# Altium project Pinger.PrjPcb
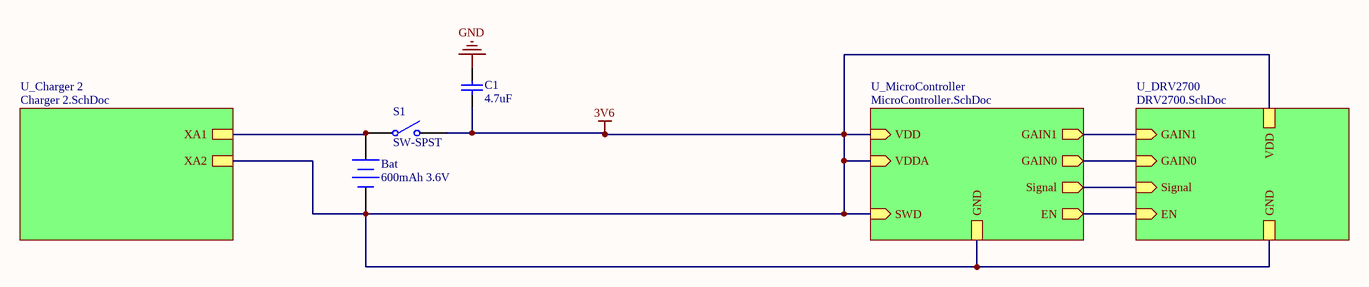
[diagram p0: Master Schematic Sheet.SchDoc]
3 sheets, 33 parts. Net scope: hierarchical (ports join the sheet entries above them; power ports are global).
Board files: Charger V3 PCB.PcbDoc, Pinger Final PCB.PcbDoc
Sheets:
  Master Schematic Sheet.SchDoc
    U_MicroController = MicroController.SchDoc
    U_DRV2700 = DRV2700.SchDoc

## Sheet Master Schematic Sheet.SchDoc
size A4

### Parts
(Parts that share a designator on the sheet are numbered #1, #2 ... from top to bottom, then left to right.)
Bat  600mAh 3.6V  [*FCI_10118193-0001LF_10118193-0001LF(Primary)]
C1#1  value 4.7uF  [CAPC1608N(0603")]  (hidden comment: Cap)
S1  SW-SPST  [SPST-2]

### Sub-sheets
U_Charger 2 = Charger 2.SchDoc (file not in this document): XA1, XA2
U_DRV2700 = DRV2700.SchDoc: EN (in), GAIN0 (in), GAIN1 (in), Signal (in), VDD, GND
U_MicroController = MicroController.SchDoc: GAIN1 (out), GAIN0 (out), Signal (out), EN (out), VDD (in), VDDA (in), GND, SWD (in)

### Nets
3V6: Bat.2(-) C1#1.2 S1.2(NO) ; sheet U_Charger 2/XA2, sheet U_MicroController/VDD, sheet U_MicroController/VDDA, sheet U_MicroController/GND, sheet U_MicroController/SWD, sheet U_DRV2700/VDD, sheet U_DRV2700/GND
GND: C1#1.1
NetBat_1: Bat.1(+) S1.1(COMMON) ; sheet U_Charger 2/XA1
NetDRV_19: sheet U_MicroController/GAIN1, sheet U_DRV2700/GAIN1
NetDRV_20: sheet U_MicroController/EN, sheet U_DRV2700/EN
NetDVR-C3_2: sheet U_MicroController/Signal, sheet U_DRV2700/Signal
NetSTM_12: sheet U_MicroController/GAIN0, sheet U_DRV2700/GAIN0

### Library data of the parts
Bat = Battery: Multicell Battery; Published: 24-Mar-1999; LatestRevisionDate: 17-Jul-2002; LatestRevisionNote: Re-released for DXP Platform.; PackageReference: BAT-2; Publisher: Altium Limited; PackageDescription: Battery; 2 Leads
C1#1 = Cap: Capacitor; Published: 8-Jun-2000; LatestRevisionDate: 17-Jul-2002; LatestRevisionNote: Re-released for DXP Platform.; PackageReference: RAD-0.3; Publisher: Altium Limited; PackageDescription: Radial Cap, Thru-Hole; 2 Leads; 0.3 in Pin Spacing
S1 = SW-SPST: Single-Pole, Single-Throw Switch; Published: 24-Mar-1999; LatestRevisionDate: 17-Jul-2002; LatestRevisionNote: Re-released for DXP Platform.; PackageReference: SPST-2; Publisher: Altium Limited; PackageDescription: Switch; 2 Leads

## Sheet MicroController.SchDoc
size A4; CompanyName: AUVIC; DrawnBy: Aman Nijjar; Organization: AUVIC; DocumentNumber: 2; Revision: 0; SheetNumber: 2; SheetTotal: 3; DocumentName: Pinger; ProjectName: Pinger
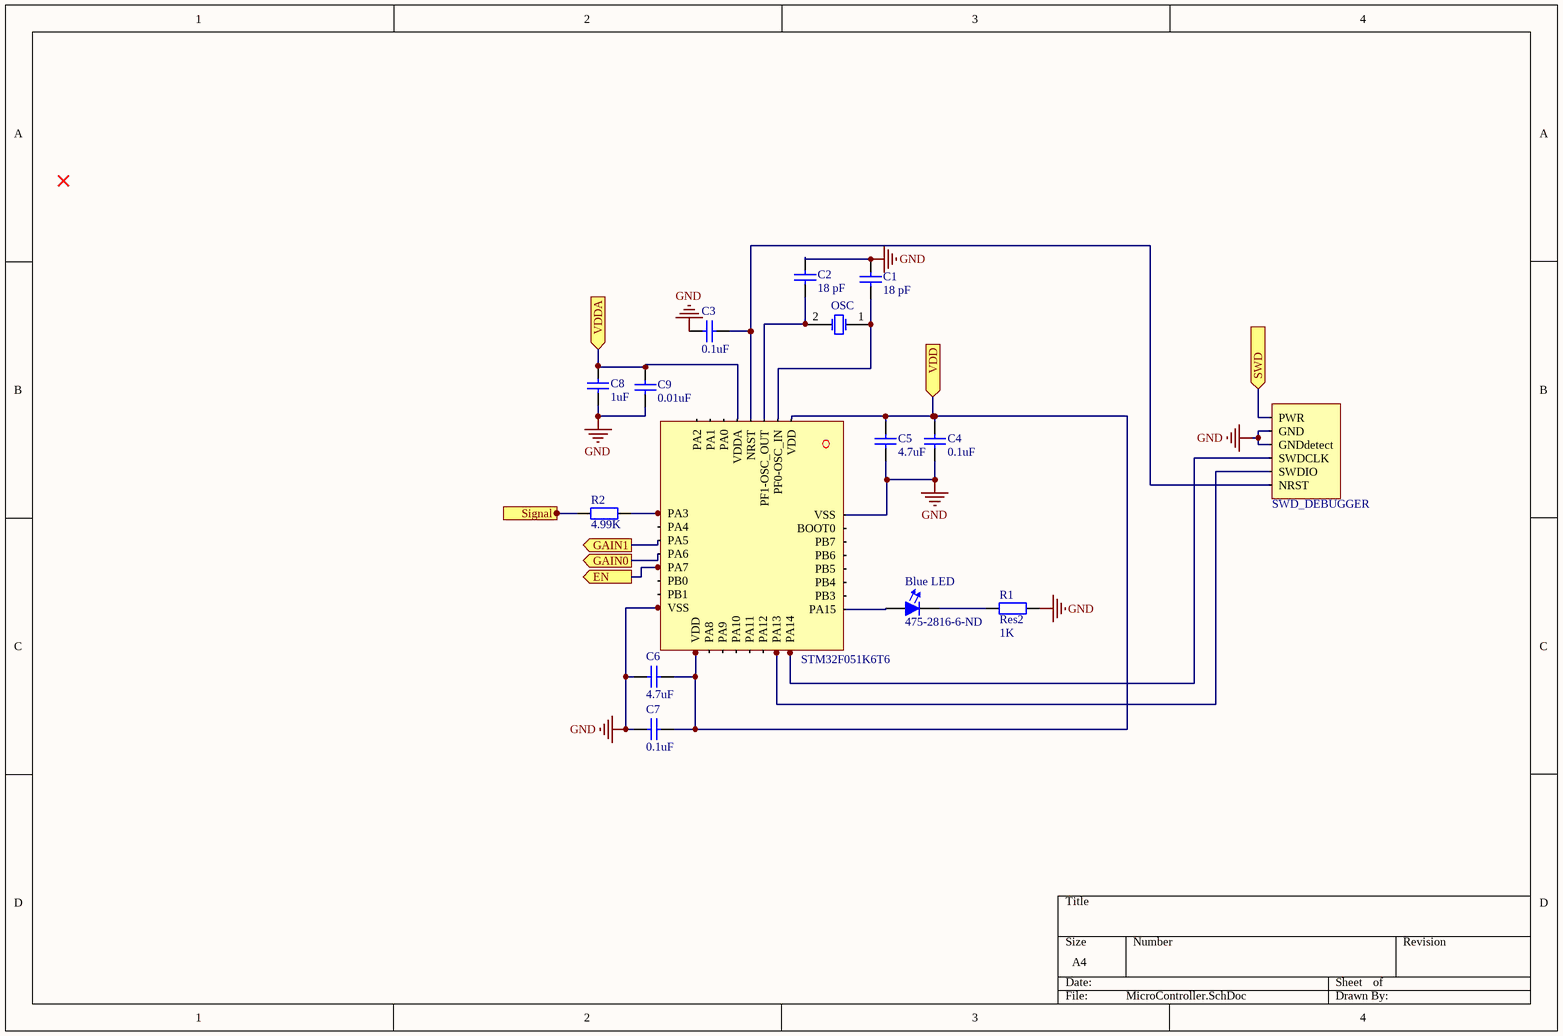
[diagram p1: MicroController.SchDoc]

### Parts
(Parts that share a designator on the sheet are numbered #1, #2 ... from top to bottom, then left to right.)
Blue_LED  Supplier Part Number 1: 475-2816-6-ND  [LED0603]  (hidden comment: Blue)
C1#2  value 18 pF  [CAPC1608N(0603")]  (hidden comment: Cap)
C2  value 18 pF  [CAPC1608N(0603")]  (hidden comment: Cap)
C3  value 0.1uF  [CAPC1608N(0603")]  (hidden comment: Cap)
C4  value 0.1uF  [CAPC1608N(0603")]  (hidden comment: Cap)
C5  value 4.7uF  [CAPC1608N(0603")]  (hidden comment: Cap)
C6  value 4.7uF  [CAPC1608N(0603")]  (hidden comment: Cap)
C7  value 0.1uF  [CAPC1608N(0603")]  (hidden comment: Cap)
C8  value 1uF  [CAPC1608N(0603")]  (hidden comment: Cap)
C9  value 0.01uF  [CAPC1608N(0603")]  (hidden comment: Cap)
DEBUG  SWD_DEBUGGER  [Male_header]
OSC  ABMM2-14.7456MHZ-E2-T  [*OSCSC320X250X100N]  (value not drawn)
R1  Res2  value 1K  [RESC1608N(0603")]
R2  value 4.99K  [RESC1608N(0603")]  (hidden comment: Res2)
STM  STM32F051K6T6  [TQFP68P900X900X160-32N]

### Ports
EN (out), GAIN0 (out), GAIN1 (out), Signal (out), SWD (in), VDD (in), VDDA (in)

### Nets
3V6: C4.1 C5.1 C6.1 C7.1 C8.1 C9.1 DEBUG.1(PWR) STM.17(VDD) ; port VDD, port VDDA, port SWD
GND: C1#2.2 C2.2 C3.1 C4.2 C5.2 C6.2 C7.2 C8.2 C9.2 DEBUG.2(GND) DEBUG.3(GNDdetect) R1.2 STM.16(VSS) STM.32(VSS)
NetBlue_LED_1: Blue_LED.1(Cathode) R1.1
NetBlue_LED_2: Blue_LED.2(Anode) STM.25(PA15)
NetC1#2_1: C1#2.1 OSC.1(OSC1)
NetC2_1: C2.1 OSC.2(OSC2) STM.3(PF1-OSC_OUT)
NetC3_2: C3.2 DEBUG.6(NRST) STM.4(NRST)
NetDEBUG_4: DEBUG.4(SWDCLK) STM.24(PA14)
NetDEBUG_5: DEBUG.5(SWDIO) STM.23(PA13)
NetDRV_19: STM.11(PA5) ; port GAIN1
NetDRV_20: STM.13(PA7) ; port EN
NetDVR-C3_2: R2.1 ; port Signal
NetR2_2: R2.2 STM.9(PA3)
NetSTM_12: STM.12(PA6) ; port GAIN0

Not connected (* = marked no-connect by the designer): STM 1(VDD) 2(PF0-OSC_IN) 5(VDDA) 6(PA0) 7(PA1) 8(PA2) 10(PA4) 14(PB0) 15(PB1) 18(PA8) 19(PA9) 20(PA10) 21(PA11) 22(PA12) 26(PB3) 27(PB4) 28(PB5) 29(PB6) 30(PB7) 31(BOOT0)

### Library data of the parts
Blue_LED = LED, 0603 (1608), Blue, Clear: Colour: Blue; Created By: Lyden Smith; Date Created: 2017-09-19; Supplier 1: Digi-Key
C1#2 C2-C9 = Cap: Capacitor; Published: 8-Jun-2000; LatestRevisionDate: 17-Jul-2002; LatestRevisionNote: Re-released for DXP Platform.; PackageReference: RAD-0.3; Publisher: Altium Limited; PackageDescription: Radial Cap, Thru-Hole; 2 Leads; 0.3 in Pin Spacing
DEBUG = SWD_Header
OSC = XTAL: Crystal Oscillator; Published: 8-Jun-2000; LatestRevisionDate: 17-Jul-2002; LatestRevisionNote: Re-released for DXP Platform.; PackageReference: R38; Publisher: Altium Limited; PackageDescription: Crystal, Thru-Hole; 2 Leads; Body 3.1 x 8.2 mm (Dia.xH)
R1 R2 = Res2: Resistor; Published: 8-Jun-2000; LatestRevisionDate: 17-Jul-2002; LatestRevisionNote: Re-released for DXP Platform.; PackageReference: AXIAL-0.4; Publisher: Altium Limited; PackageDescription: Axial Device, Thru-Hole; 2 Leads; 0.4 in Pin Spacing
STM = STM32F051K6T6: Supplier 1: Mouser; Supplier Part Number 1: 511-STM32F051K6T6

## Sheet DRV2700.SchDoc
size A4
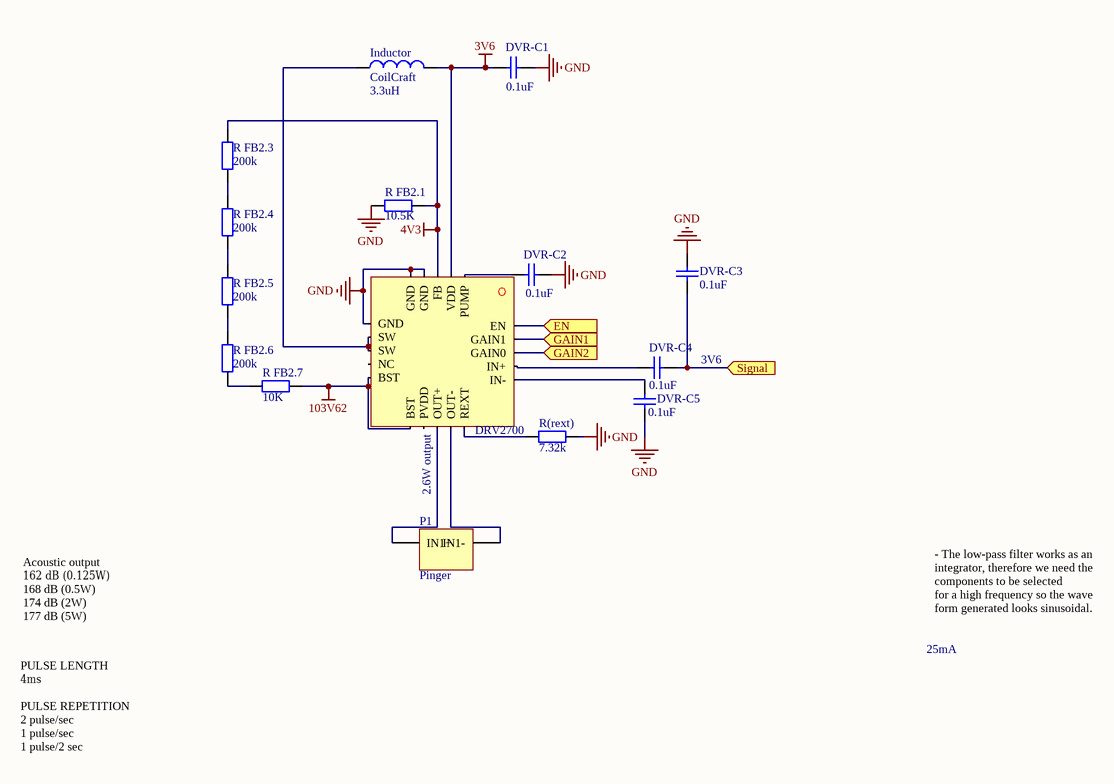
[diagram p2: DRV2700.SchDoc]

### Parts
DRV  DRV2700  [QFN50P400X400X100_HS-21N]
DVR-C1  value 0.1uF  [CAPC1608N(0603")]  (hidden comment: +10V rating and X5R or X7R)
DVR-C2  value 0.1uF  [CAPC1608N(0603")]  (hidden comment: +10V rating and X5R or X7R)
DVR-C3  value 0.1uF  [CAPC1608N(0603")]  (hidden comment: Cap)
DVR-C4  value 0.1uF  [CAPC1608N(0603")]  (hidden comment: Cap)
DVR-C5  value 0.1uF  [CAPC1608N(0603")]  (hidden comment: Cap)
Inductor  CoilCraft  value 3.3uH  [INDP2828X23N]
P1  Pinger  [*JST_XHP-2]
R(rext)  value 7.32k  [RESC1608N(0603")]  (hidden comment: Res2)
R_FB2.1  value 10.5K  [RESC1608N(0603")]  (hidden comment: Res2)
R_FB2.3  value 200k  [RESC1608N(0603")]  (hidden comment: Res2)
R_FB2.4  value 200k  [RESC1608N(0603")]  (hidden comment: Res2)
R_FB2.5  value 200k  [RESC1608N(0603")]  (hidden comment: Res2)
R_FB2.6  value 200k  [RESC1608N(0603")]  (hidden comment: Res2)
R_FB2.7  value 10K  [RESC1608N(0603")]  (hidden comment: Res2)

### Ports
EN (in), GAIN1 (in), GAIN2 (in), Signal (in)

### Nets
3V6: DRV.2(VDD) DVR-C1.2 Inductor.2
4V3: DRV.3(FB) R_FB2.1.2 R_FB2.3.1
103V62: DRV.10(BST) DRV.11(BST) R_FB2.7.2
GND: DRV.4(GND) DRV.5(GND) DRV.6(GND) DVR-C1.1 DVR-C2.1 DVR-C3.1 DVR-C5.1 R(rext).1 R_FB2.1.1
NetDRV_1: DRV.1(PUMP) DVR-C2.2
NetDRV_7: DRV.7(SW) DRV.8(SW) Inductor.1
NetDRV_13: DRV.13(OUT+) P1.1(IN1+)
NetDRV_14: DRV.14(OUT-) P1.2(IN1-)
NetDRV_15: DRV.15(REXT) R(rext).2
NetDRV_16: DRV.16(IN-) DVR-C5.2
NetDRV_17: DRV.17(IN+) DVR-C4.2
NetDRV_18: DRV.18(GAIN0) ; port GAIN2
NetDRV_19: DRV.19(GAIN1) ; port GAIN1
NetDRV_20: DRV.20(EN) ; port EN
NetDVR-C3_2: DVR-C3.2 DVR-C4.1 ; port Signal
NetR_FB2.3_2: R_FB2.3.2 R_FB2.4.1
NetR_FB2.4_2: R_FB2.4.2 R_FB2.5.1
NetR_FB2.5_2: R_FB2.5.2 R_FB2.6.1
NetR_FB2.6_2: R_FB2.6.2 R_FB2.7.1

Not connected (* = marked no-connect by the designer): DRV 9(NC) 12(PVDD)

### Notes on the sheet
- (near DVR-C4) 3V6
- (near DRV) 2.6W output
- Acoustic output
  ​162 dB (0.125W)
  168 dB (0.5W)
  174 dB (2W)
  177 dB (5W)
- 25mA
- - The low-pass filter works as an integrator, therefore we need the components to be selected
  for a high frequency so the wave form generated looks sinusoidal.
- PULSE LENGTH
  ​4ms
  PULSE REPETITION
  2 pulse/sec
  1 pulse/sec
  1 pulse/2 sec

### Library data of the parts
DVR-C1-DVR-C3 = Cap: Capacitor; Published: 8-Jun-2000; LatestRevisionDate: 17-Jul-2002; LatestRevisionNote: Re-released for DXP Platform.; PackageReference: RAD-0.3; Publisher: Altium Limited; PackageDescription: Radial Cap, Thru-Hole; 2 Leads; 0.3 in Pin Spacing
DVR-C4 = Cap: must have 105V rating; Published: 8-Jun-2000; LatestRevisionDate: 17-Jul-2002; LatestRevisionNote: Re-released for DXP Platform.; PackageReference: RAD-0.3; Publisher: Altium Limited; PackageDescription: Radial Cap, Thru-Hole; 2 Leads; 0.3 in Pin Spacing
DVR-C5 = Cap: must have a 105V rating; Published: 8-Jun-2000; LatestRevisionDate: 17-Jul-2002; LatestRevisionNote: Re-released for DXP Platform.; PackageReference: RAD-0.3; Publisher: Altium Limited; PackageDescription: Radial Cap, Thru-Hole; 2 Leads; 0.3 in Pin Spacing
Inductor = Inductor: LPS4018-332MLB; Code_IEC: 1005; Published: 8-Jun-2000; LatestRevisionDate: 29-May-2009; LatestRevisionNote: IPC-7351 Footprint Added.; PackageReference: 0402-A; Publisher: Altium Limited; PackageDescription: Chip Inductor; Code_JEITA: 0402
P1 = Header 2X2: Header, 2-Pin, Dual row; LatestRevisionDate: 17-Jul-2002; LatestRevisionNote: Re-released for DXP Platform.; Publisher: Altium Limited
R(rext) = Res2: Current-Limiting Control Resistor; Published: 8-Jun-2000; LatestRevisionDate: 17-Jul-2002; LatestRevisionNote: Re-released for DXP Platform.; PackageReference: AXIAL-0.4; Publisher: Altium Limited; PackageDescription: Axial Device, Thru-Hole; 2 Leads; 0.4 in Pin Spacing
R_FB2.1 R_FB2.3-R_FB2.7 = Res2: Resistor; Published: 8-Jun-2000; LatestRevisionDate: 17-Jul-2002; LatestRevisionNote: Re-released for DXP Platform.; PackageReference: AXIAL-0.4; Publisher: Altium Limited; PackageDescription: Axial Device, Thru-Hole; 2 Leads; 0.4 in Pin Spacing
  R_FB2.3-R_FB2.7: Digikey: RC0201FR-07200KL
DRV = DRV2700: Supplier 1: Mouser; Supplier Part Number 1: 595-DRV2700RGPT

## Nets that join several sheets
3V6: Master Schematic Sheet (Bat.2 C1#1.2 S1.2), MicroController (8 pins), DRV2700 (DRV.2 DVR-C1.2 Inductor.2)
GND: Master Schematic Sheet (C1#1.1), MicroController (14 pins), DRV2700 (9 pins)
NetDRV_19: MicroController (STM.11), DRV2700 (DRV.19)
NetDRV_20: MicroController (STM.13), DRV2700 (DRV.20)
NetDVR-C3_2: MicroController (R2.1), DRV2700 (DVR-C3.2 DVR-C4.1)